# Altium schematic sheet buffers_5bits.SchDoc
size A4
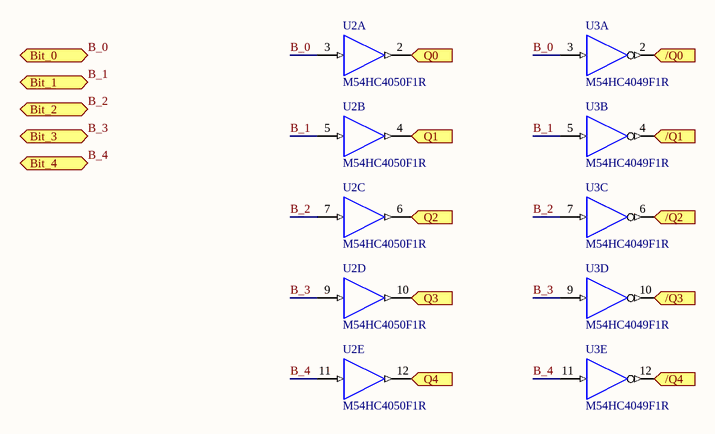
[diagram p0: buffers_5bits.SchDoc]

## Parts
U2  M54HC4050F1R  [DIP16]  (parts A,B,C,D,E of 6)
U3  M54HC4049F1R  [DIP16]  (parts A,B,C,D,E of 6)

## Ports
/Q0 (out), /Q1 (out), /Q2 (out), /Q3 (out), /Q4 (out), Bit_0 (in), Bit_1 (in), Bit_2 (in), Bit_3 (in), Bit_4 (in), Q0 (out), Q1 (out), Q2 (out), Q3 (out), Q4 (out)

## Nets
GND: U2.8(GND) U3.8(GND)
VCC: U2.1(VCC) U3.1(VCC)
/Q0: U3.2(Y) ; port /Q0
/Q1: U3.4(Y) ; port /Q1
/Q2: U3.6(Y) ; port /Q2
/Q3: U3.10(Y) ; port /Q3
/Q4: U3.12(Y) ; port /Q4
B_0: U2.3(A) U3.3(A) ; port Bit_0
B_1: U2.5(A) U3.5(A) ; port Bit_1
B_2: U2.7(A) U3.7(A) ; port Bit_2
B_3: U2.9(A) U3.9(A) ; port Bit_3
B_4: U2.11(A) U3.11(A) ; port Bit_4
Q0: U2.2(Y) ; port Q0
Q1: U2.4(Y) ; port Q1
Q2: U2.6(Y) ; port Q2
Q3: U2.10(Y) ; port Q3
Q4: U2.12(Y) ; port Q4

## Library data of the parts
U2 = M54HC4050F1R: Hex Buffer/Converter Non-Inverting; Note: Pins 13 and 16 are not connected and not drawn.; Published: 8-Jun-2000; LatestRevisionDate: 06-Jun-2005; LatestRevisionNote: Stylized 3D Model Added.; DatasheetVersion: Mar-1993; PackageVersion: Apr-1996; PackageReference: DIP16; Publisher: Altium Limited; PackageDescription: DIP; 16 Leads; Row Spacing 7.62 mm; Pitch 2.54 mm; ComponentLink1Description: Manufacturer Link; ComponentLink1URL: http://www.st.com/
U3 = M54HC4049F1R: Hex Buffer/Converter Invertering; Note: Pins 13 and 16 are not connected and not drawn.; Published: 8-Jun-2000; LatestRevisionDate: 06-Jun-2005; LatestRevisionNote: Stylized 3D Model Added.; DatasheetVersion: Mar-1993; PackageVersion: Apr-1996; PackageReference: DIP16; Publisher: Altium Limited; PackageDescription: DIP; 16 Leads; Row Spacing 7.62 mm; Pitch 2.54 mm; ComponentLink1Description: Manufacturer Link; ComponentLink1URL: http://www.st.com/